# EAGLE schematic Schematic v4 (EAGLE 9.7.0)
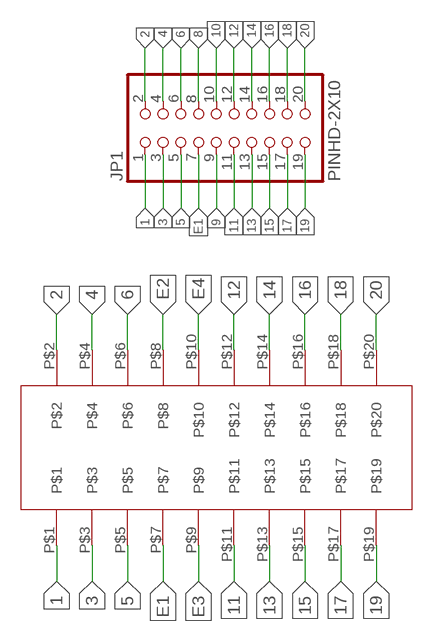
[diagram p0: schematic, sheet 1]

## Parts
JP1  PINHD-2X10  [2X10]
U$1  HEAD_CONNECTOR  [HEAD_CONNECTOR]

## Nets
1: JP1.1 U$1.P$1
2: JP1.2 U$1.P$2
3: JP1.3 U$1.P$3
4: JP1.4 U$1.P$4
5: JP1.5 U$1.P$5
6: JP1.6 U$1.P$6
8: JP1.8
9: JP1.9
10: JP1.10
11: JP1.11 U$1.P$11
12: JP1.12 U$1.P$12
13: JP1.13 U$1.P$13
14: JP1.14 U$1.P$14
15: JP1.15 U$1.P$15
16: JP1.16 U$1.P$16
17: JP1.17 U$1.P$17
18: JP1.18 U$1.P$18
19: JP1.19 U$1.P$19
20: JP1.20 U$1.P$20
E1: JP1.7 U$1.P$7
E2: U$1.P$8
E3: U$1.P$9
E4: U$1.P$10

## Library data of the parts
JP1 = Connector:PINHD-2X10: PIN HEADER; CATEGORY: Headers; DESCRIPTION: Header-Straight-2x10 Position; PACKAGE_TYPE: THT; PITCH: 0.100" (2.54mm); SUBCATEGORY: Headers-Male Pins; TYPE: Board to Board or Cable-Unshrouded-Through Hole-Straight
U$1 = PNP:HEAD_CONNECTOR